# EAGLE design AuxBreak (EAGLE 6.5.0)
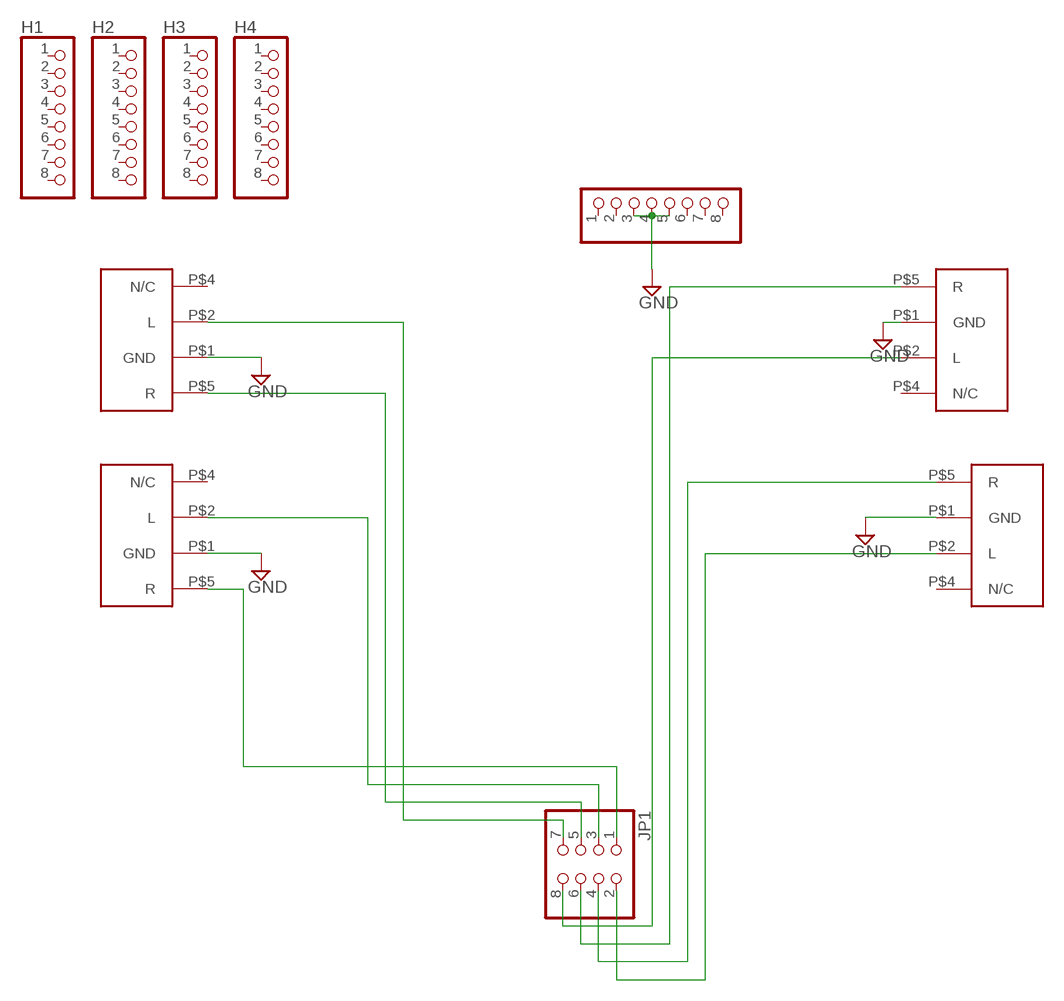
[diagram p0: schematic, sheet 1]

## Parts
H1  PINHD-1X8  [1X08]
H2  PINHD-1X8  [1X08]
H3  PINHD-1X8  [1X08]
H4  PINHD-1X8  [1X08]
H5  PINHD-1X8  [1X08]
JP1  PINHD-2X4/90  [2X04/90]
U$1  161-3509-E  [161-3509-E]
U$3  161-3509-E  [161-3509-E]
U$4  161-3509-E  [161-3509-E]
U$5  161-3509-E  [161-3509-E]

## Nets
GND: H5.3 H5.4 H5.5 U$1.P$1(GND) U$3.P$1(GND) U$4.P$1(GND) U$5.P$1(GND)
N$1: JP1.7 U$5.P$2(L)
N$2: JP1.5 U$5.P$5(R)
N$3: JP1.3 U$4.P$2(L)
N$4: JP1.1 U$4.P$5(R)
N$5: JP1.8 U$1.P$2(L)
N$6: JP1.6 U$1.P$5(R)
N$7: JP1.4 U$3.P$5(R)
N$8: JP1.2 U$3.P$2(L)
Unconnected: H1.1 H1.2 H1.3 H1.4 H1.5 H1.6 H1.7 H1.8 H2.1 H2.2 H2.3 H2.4 H2.5 H2.6 H2.7 H2.8 H3.1 H3.2 H3.3 H3.4 H3.5 H3.6 H3.7 H3.8 H4.1 H4.2 H4.3 H4.4 H4.5 H4.6 H4.7 H4.8 H5.1 H5.2 H5.6 H5.7 H5.8 U$1.P$4(N/C) U$3.P$4(N/C) U$4.P$4(N/C) U$5.P$4(N/C)

## Library data of the parts
H1-H5 = pinhead:PINHD-1X8: PIN HEADER
JP1 = pinhead:PINHD-2X4: PIN HEADER
U$1 U$3-U$5 = C1-2015:161-3509-E

## Board
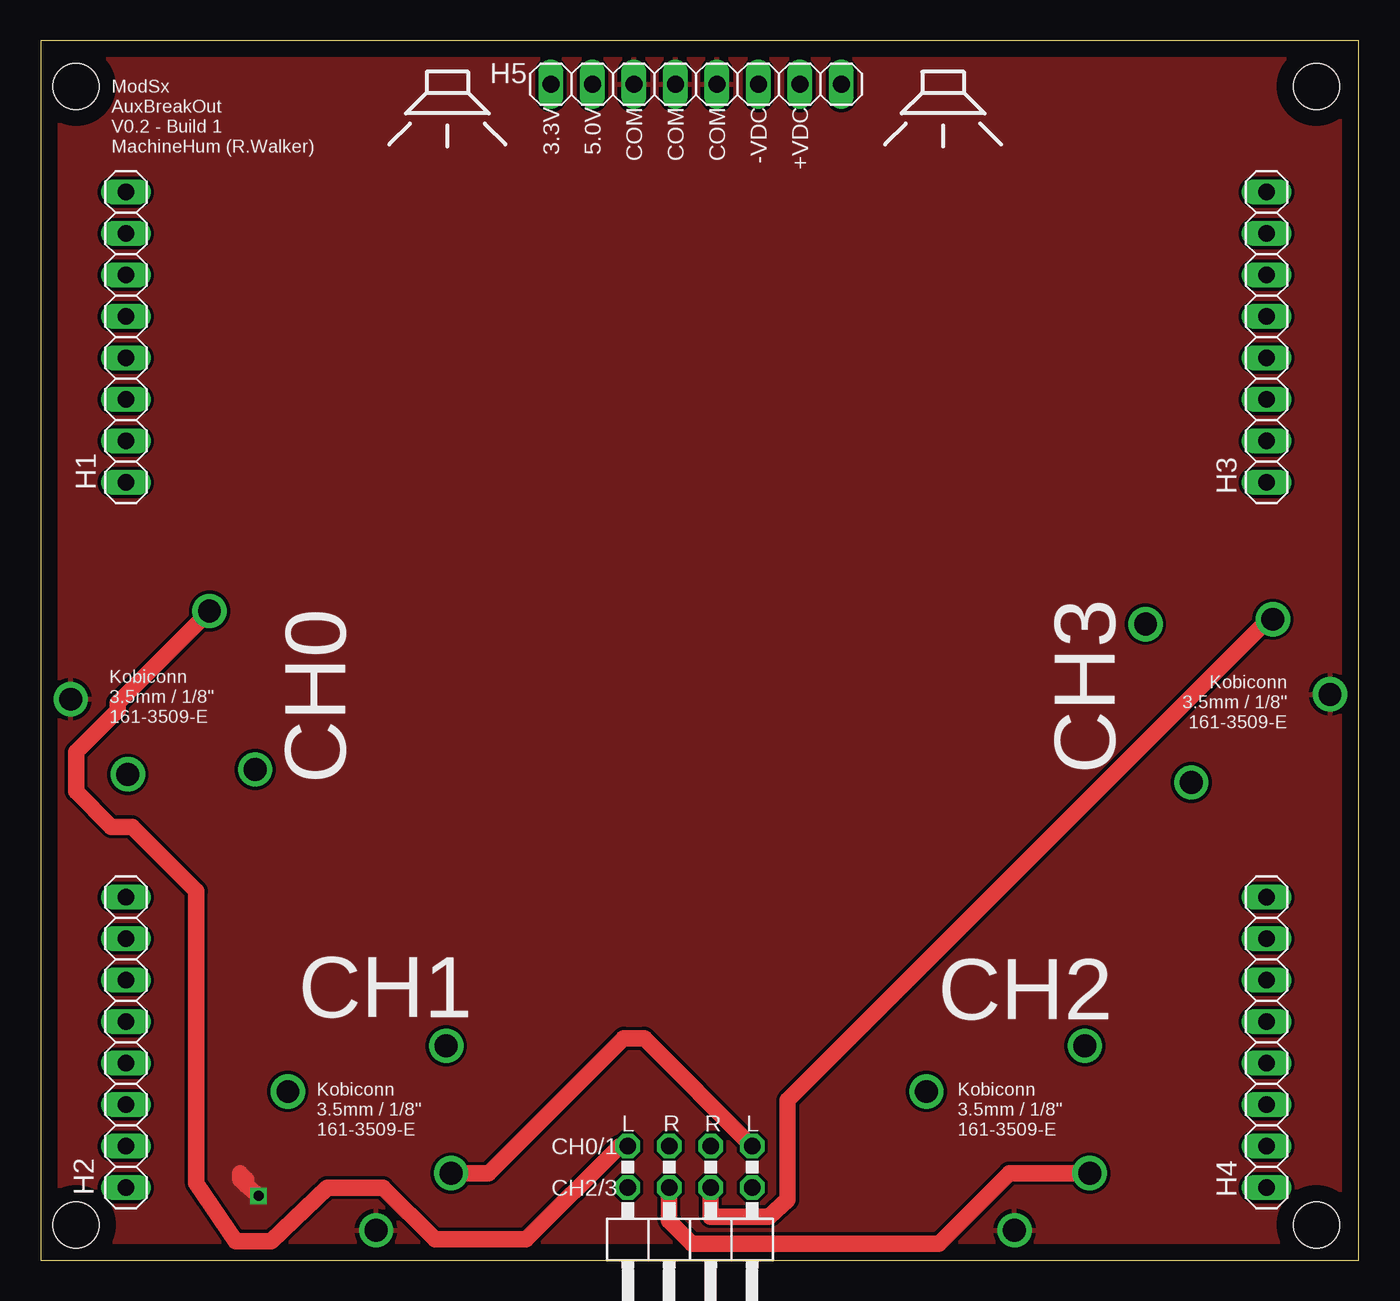
[diagram p1: board, top side]
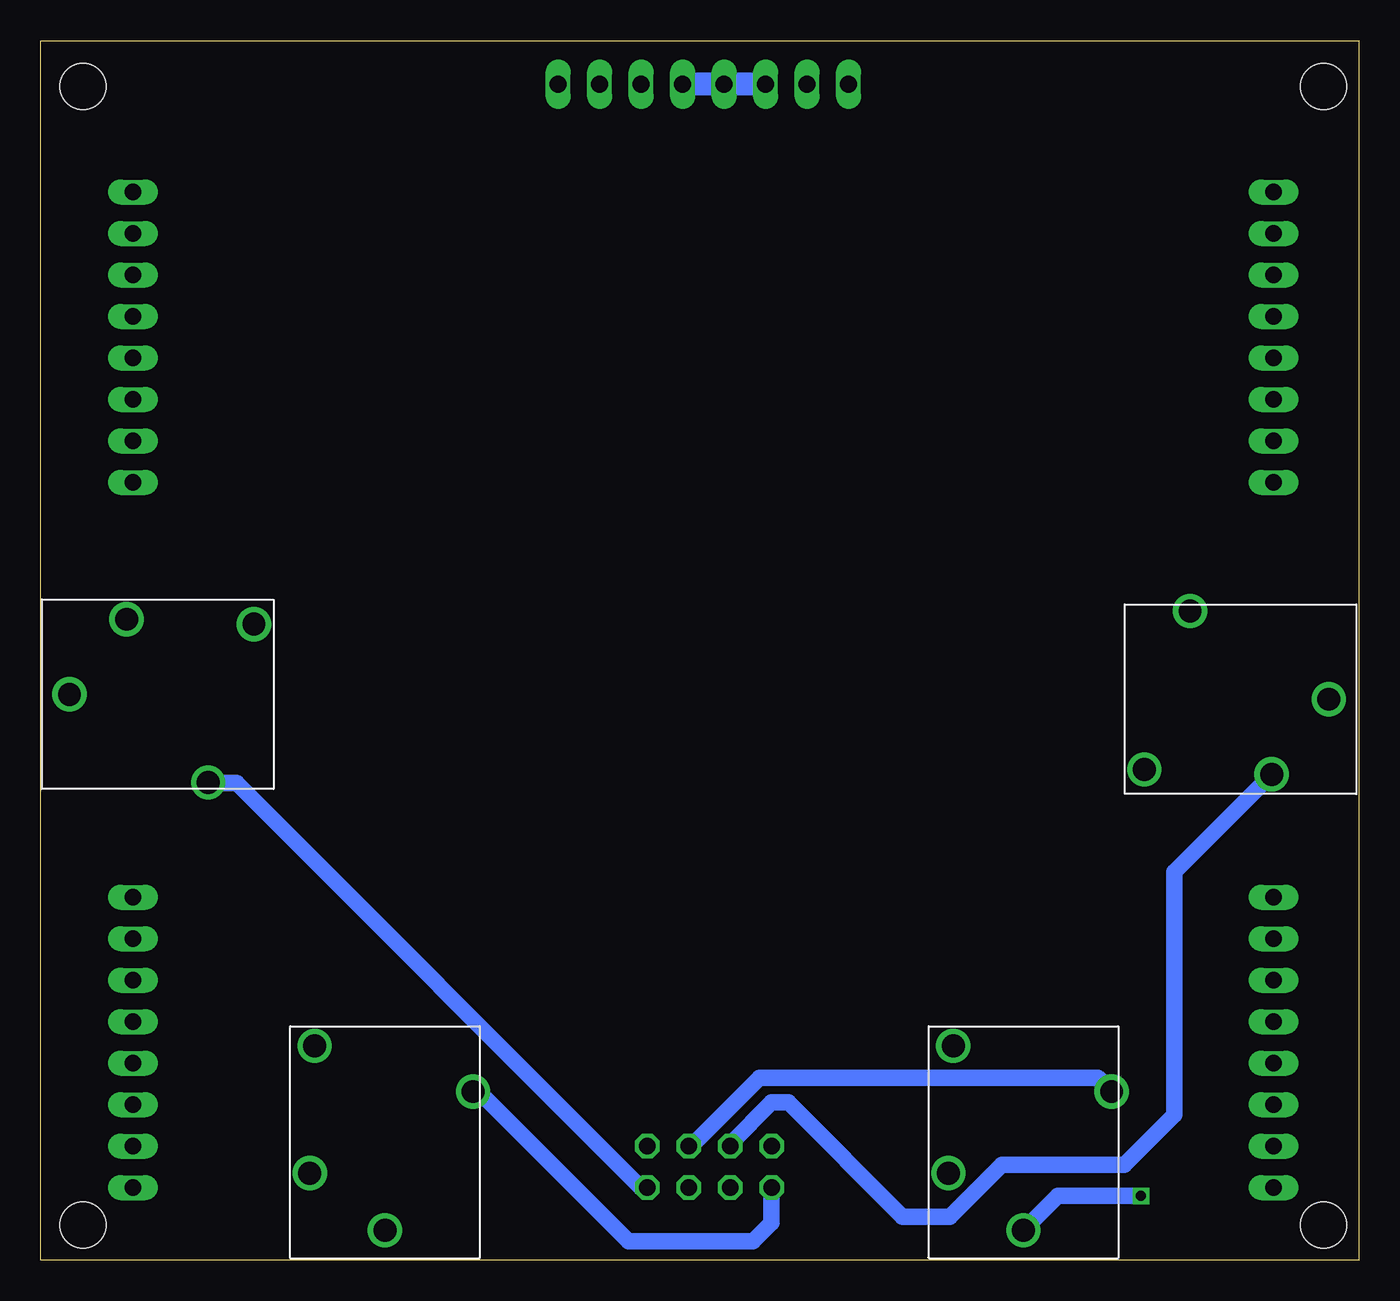
[diagram p2: board, bottom side, seen from below]

Size 80.7 x 74.67 mm. Coordinates in mm from the lower left corner, seen from the top.
Outline: 0,0 80.7,0 80.7,74.67 0,74.67 0,0
Copper layers (1*16): Top 0.035mm / dielectric 1.5mm / Bottom 0.035mm
Design rules "default": minimum track width 10mil, minimum drill 24mil, track to track 8mil, track to pad 8mil, pad to pad 8mil, via to via 8mil, smd to smd 8mil, copper to edge 40mil, drill to drill 8mil, minimum pad ring 10mil, minimum via ring 8mil, stop-mask expansion 4mil, vias tented up to drill 0mil, thermal gap 10mil
Holes 2.8 mm at 2.16,71.88 2.16,2.16 78.11,71.88 78.11,2.16

### Footprints (pad centres in the part's own frame; a part is rotated, then mirrored left to right if it is on the bottom)
1X08 = drill 1.016 long: 1 -8.89,0; 2 -6.35,0; 3 -3.81,0; 4 -1.27,0; 5 1.27,0; 6 3.81,0; 7 6.35,0; 8 8.89,0
2X04/90 = drill 1.016 octagon: 1 -3.81,-6.35; 2 -3.81,-3.81; 3 -1.27,-6.35; 4 -1.27,-3.81; 5 1.27,-6.35; 6 1.27,-3.81; 7 3.81,-6.35; 8 3.81,-3.81
161-3509-E = drill 1.4: P$1 1.7,-5.8; P$2 10.2,-11.2; P$4 13,-1.5; P$5 5.2,-1.2

### Placement (x,y rotation side)
H1  5.21,56.52 90 top
H2  5.21,13.34 90 top
H3  75.06,56.52 90 top
H4  75.06,13.34 90 top
H5  40.13,72.01 0 top
JP1  39.75,0.64 180 top
U$1  65.42,0.13 90 bottom
U$3  80.64,40.45 0 bottom
U$4  26.33,0.13 90 bottom
U$5  0.13,28.55 180 bottom

### Tracks (layer width: path | path; a pad name or v marks a point on that pad's centre or on a via)
GND  (via drill 0.6)
  Top 1.016: v13.34,3.94 12.57,4.57 | 12.57,4.57 12.19,4.95 12.19,5.33 12.57,4.95 12.57,4.57
  Bottom 1.016: U$4.P$1 18.42,3.94 v13.34,3.94
  Bottom 1.422: H5.3 H5.4 H5.5
  pour Top (isolate 0.012): 0.13,0.13 0.13,74.55 80.52,74.55 80.52,0.13
N$1
  Top 1.016: JP1.7 35.43,6.99 29.72,1.27 24.13,1.27 20.95,4.45 17.53,4.45 14.1,1.14 11.94,1.14 9.53,4.7 9.53,22.61 5.59,26.54 4.32,26.54 2.16,28.7 2.16,31.11 4.7,33.66 4.7,34.12 U$5.P$2
N$2
  Bottom 1.016: JP1.5 38.48,7.11 35.94,9.65 34.92,9.65 27.94,2.67 25.02,2.67 21.84,5.84 14.35,5.84 11.3,8.89 11.3,23.78 U$5.P$5
N$3
  Bottom 1.016: JP1.3 40.89,6.99 36.7,11.18 15.97,11.18 U$4.P$2
N$4
  Top 1.016: U$4.P$5 27.43,5.33 35.69,13.59 36.96,13.59 JP1.1
N$5
  Bottom 1.016: U$1.P$2 53.89,10.33 44.7,1.14 37.08,1.14 35.94,2.29 JP1.8
N$6
  Top 1.016: U$1.P$5 59.3,5.33 54.99,1.02 39.88,1.02 38.48,2.41 JP1.6
N$7
  Top 1.016: U$3.P$5 75.19,39.25 45.72,9.78 45.72,3.68 44.58,2.67 41.02,2.67 JP1.4
N$8
  Bottom 1.016: JP1.2 43.94,4.45 68.71,29.21 70.41,29.21 U$3.P$2

### Text on the board
tPlace: 3.3V | 5.0V | COM | COM | COM | -VDC | +VDC | ModSx / AuxBreakOut / V0.2 - Build 1 / MachineHum (R.Walker) | CH0 | Kobiconn / 3.5mm / 1/8'' / 161-3509-E | Kobiconn / 3.5mm / 1/8'' / 161-3509-E | CH3 | CH1 | CH2 | Kobiconn / 3.5mm / 1/8'' / 161-3509-E | L | R | R | L | Kobiconn / 3.5mm / 1/8'' / 161-3509-E | CH0/1 | CH2/3